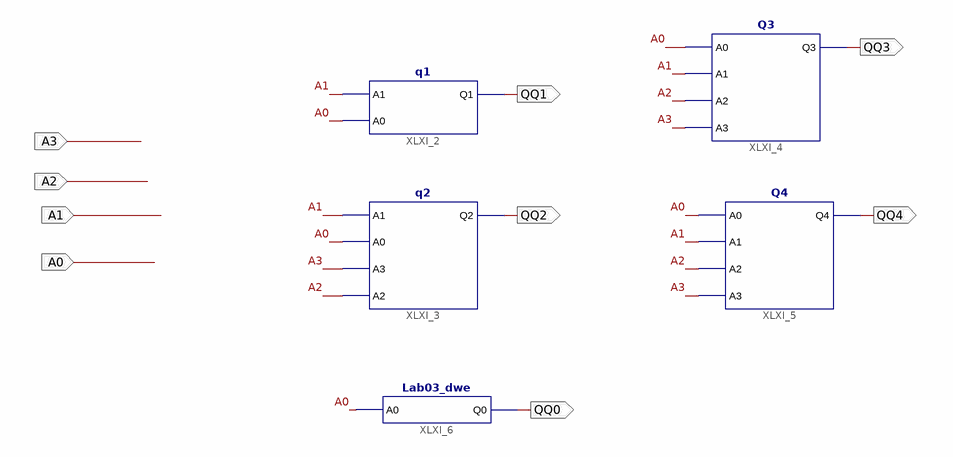
[diagram p0: schematic sheet 1]
// Xilinx ISE schematic PRELABTRIAL2.sch (spartan3) as structural Verilog: 5 symbols, 9 ports
module PRELABTRIAL2 (
  input  A3,
  input  A2,
  input  A1,
  input  A0,
  output QQ1,
  output QQ2,
  output QQ4,
  output QQ3,
  output QQ0
);

  q1 XLXI_2 (.A0(A0), .A1(A1), .Q1(QQ1));
  q2 XLXI_3 (.A0(A0), .A1(A1), .A2(A2), .A3(A3), .Q2(QQ2));
  Q3 XLXI_4 (.A0(A0), .A1(A1), .A2(A2), .A3(A3), .Q3(QQ3));
  Q4 XLXI_5 (.A0(A0), .A1(A1), .A2(A2), .A3(A3), .Q4(QQ4));
  Lab03_dwe XLXI_6 (.A0(A0), .Q0(QQ0));
endmodule
